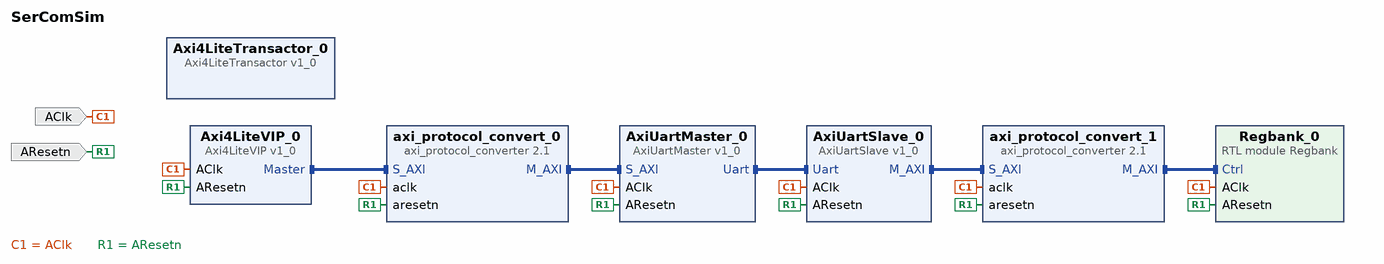
[diagram p0: block diagram of the top level]
# Vivado block design SerComSim, xc7a35ticsg324-1L, Vivado 2019.2
create_bd_design SerComSim

create_bd_port -dir I -type clk AClk
set_property -dict {CONFIG.ASSOCIATED_RESET AResetn CONFIG.FREQ_HZ 100000000} [get_bd_ports AClk]
create_bd_port -dir I -type rst AResetn

create_bd_cell -type ip -vlnv lvin:Verification:Axi4LiteVIP:v1_0 Axi4LiteVIP_0
set_property -dict {CONFIG.Mode Master} [get_bd_cells Axi4LiteVIP_0]
create_bd_cell -type ip -vlnv xilinx.com:ip:axi_protocol_converter:2.1 axi_protocol_convert_0
create_bd_cell -type ip -vlnv xilinx.com:ip:axi_protocol_converter:2.1 axi_protocol_convert_1
create_bd_cell -type ip -vlnv lvin:Verification:Axi4LiteTransactor:v1_0 Axi4LiteTransactor_0
create_bd_cell -type module -reference Regbank Regbank_0
create_bd_cell -type ip -vlnv lvin:Interfaces:AxiUartMaster:v1_0 AxiUartMaster_0
create_bd_cell -type ip -vlnv lvin:Interfaces:AxiUartSlave:v1_0 AxiUartSlave_0

# ---- connections ----

connect_bd_intf_net [get_bd_intf_pins axi_protocol_convert_1/M_AXI] [get_bd_intf_pins Regbank_0/Ctrl]
connect_bd_intf_net [get_bd_intf_pins AxiUartSlave_0/M_AXI] [get_bd_intf_pins axi_protocol_convert_1/S_AXI]
connect_bd_intf_net [get_bd_intf_pins axi_protocol_convert_0/M_AXI] [get_bd_intf_pins AxiUartMaster_0/S_AXI]
connect_bd_intf_net [get_bd_intf_pins Axi4LiteVIP_0/Master] [get_bd_intf_pins axi_protocol_convert_0/S_AXI]
connect_bd_intf_net [get_bd_intf_pins AxiUartMaster_0/Uart] [get_bd_intf_pins AxiUartSlave_0/Uart]
connect_bd_net -net AClk_0_1 [get_bd_ports AClk] \
  [get_bd_pins axi_protocol_convert_0/aclk] [get_bd_pins Axi4LiteVIP_0/AClk] [get_bd_pins axi_protocol_convert_1/aclk] \
  [get_bd_pins Regbank_0/AClk] [get_bd_pins AxiUartMaster_0/AClk] [get_bd_pins AxiUartSlave_0/AClk]
connect_bd_net -net AResetn_0_1 [get_bd_ports AResetn] \
  [get_bd_pins axi_protocol_convert_0/aresetn] [get_bd_pins Axi4LiteVIP_0/AResetn] \
  [get_bd_pins axi_protocol_convert_1/aresetn] [get_bd_pins Regbank_0/AResetn] [get_bd_pins AxiUartMaster_0/AResetn] \
  [get_bd_pins AxiUartSlave_0/AResetn]

# ---- address map ----
assign_bd_address -offset 0x00000000 -range 4G -target_address_space [get_bd_addr_spaces Axi4LiteVIP_0/Master] [get_bd_addr_segs AxiUartMaster_0/S_AXI/reg0]
assign_bd_address -offset 0x00000000 -range 4G -target_address_space [get_bd_addr_spaces AxiUartSlave_0/M_AXI] [get_bd_addr_segs Regbank_0/Ctrl/reg0]

validate_bd_design
save_bd_design
